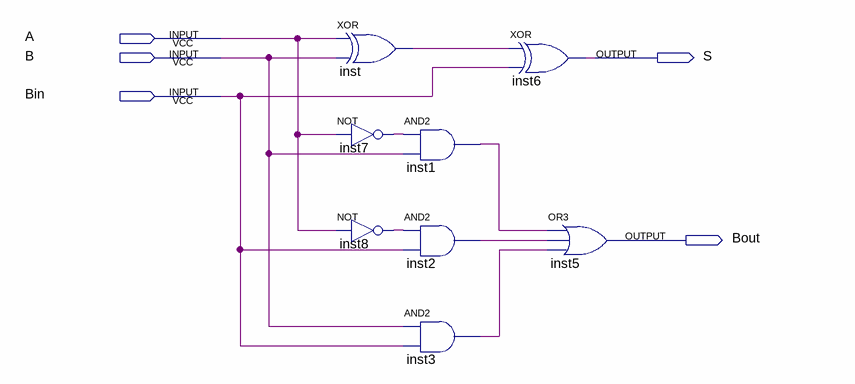
[diagram p0: schematic sheet]
// Quartus schematic SUB.bdf as structural Verilog: 8 symbols, 5 pins
module SUB (
  input  A,
  input  B,
  input  Bin,
  output S,
  output Bout
);

  wire inst1_out, inst2_out, inst3_out, inst7_out, inst8_out, inst_out;

  xor inst (inst_out, A, B);
  not inst7 (inst7_out, A);
  not inst8 (inst8_out, A);
  and inst1 (inst1_out, inst7_out, B);
  and inst2 (inst2_out, inst8_out, Bin);
  and inst3 (inst3_out, B, Bin);
  xor inst6 (S, inst_out, Bin);
  or inst5 (Bout, inst1_out, inst2_out, inst3_out);
endmodule
